# EAGLE schematic sensorBoardSchematic (EAGLE 7.5.0)
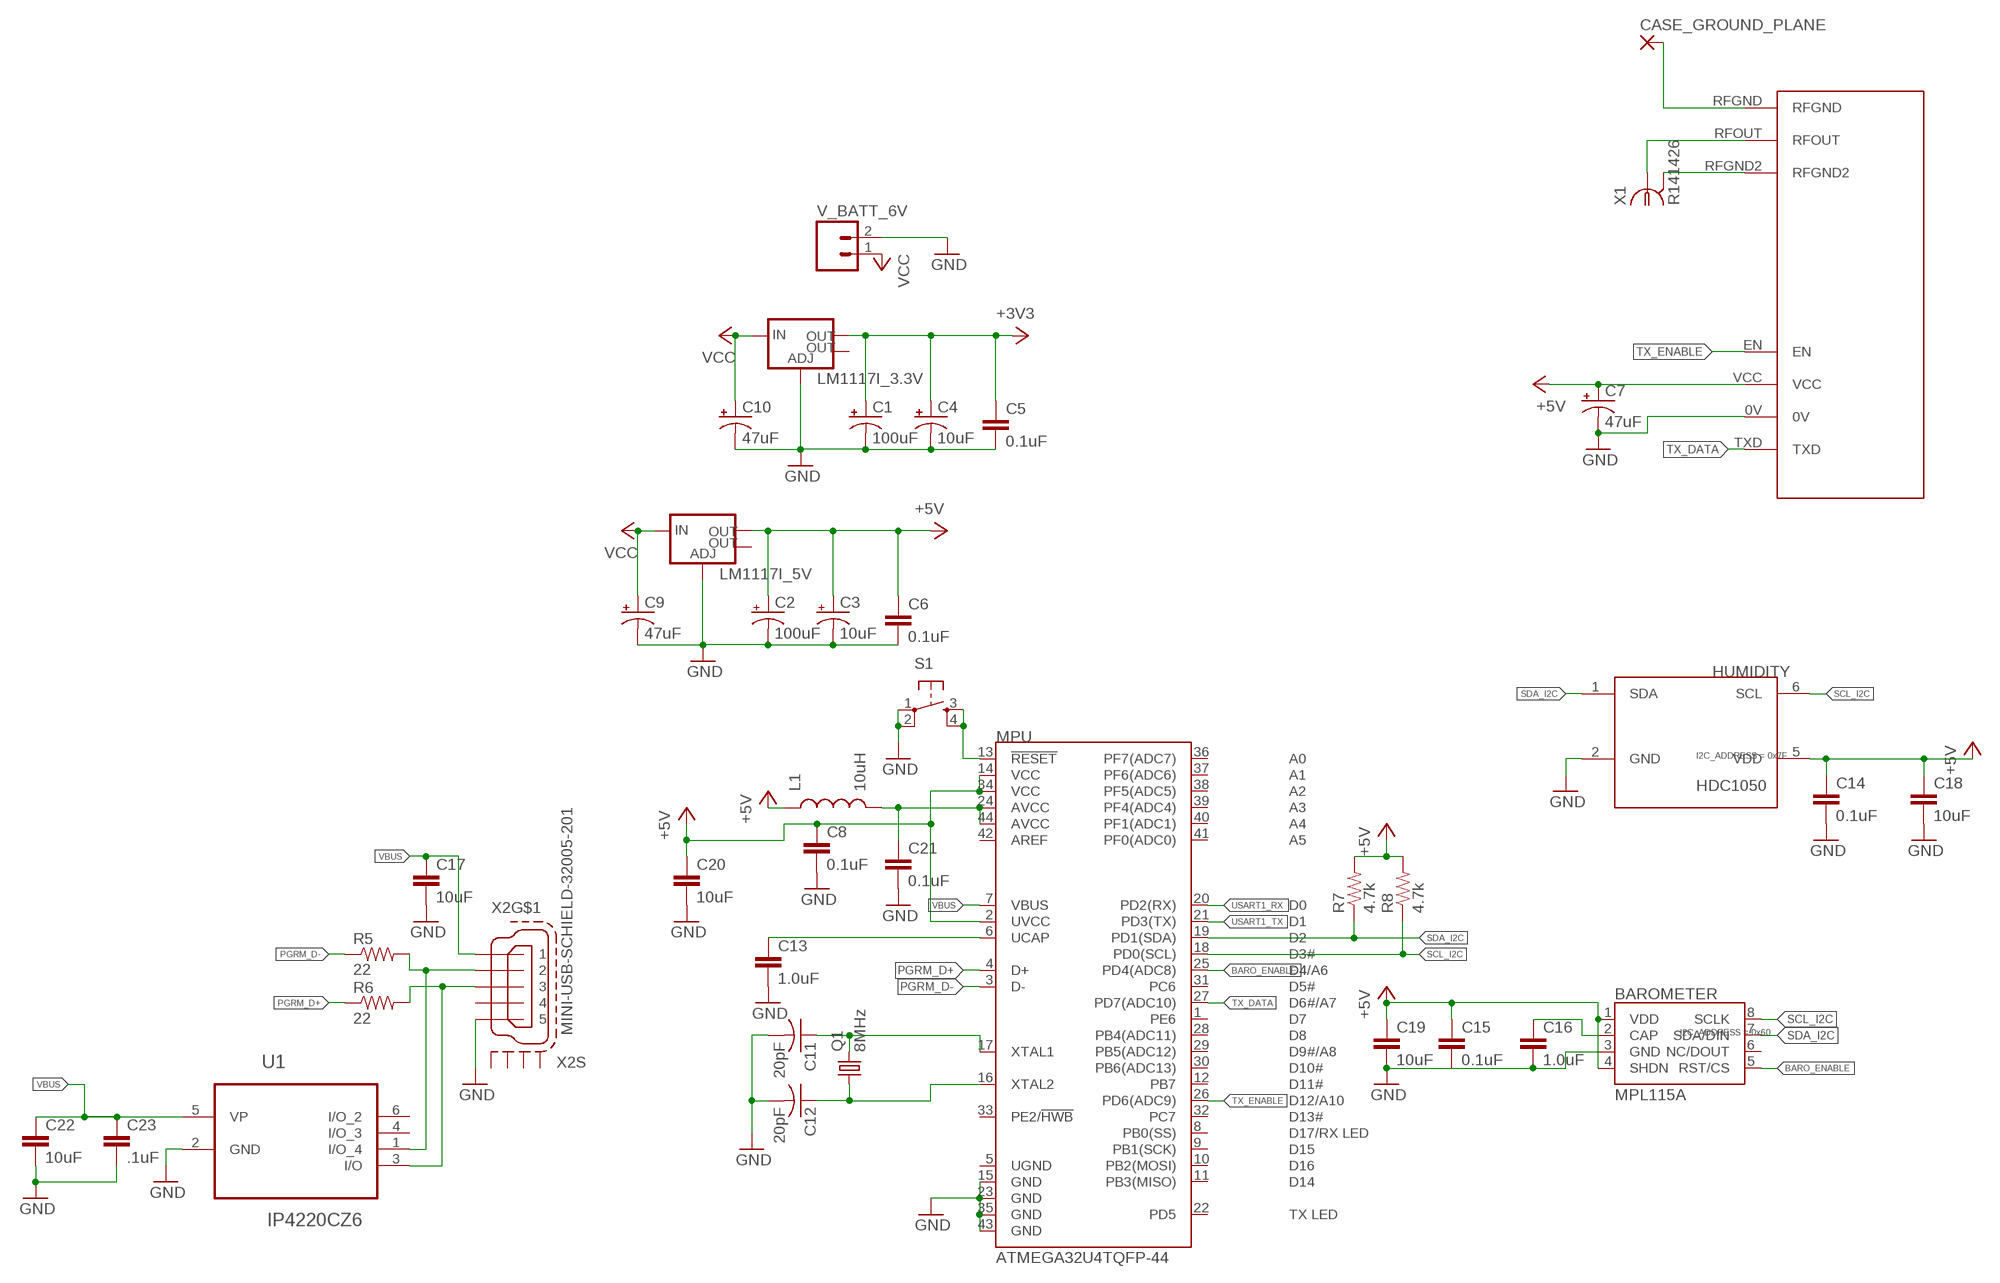
[diagram p0: schematic, sheet 1]

## Parts
BAROMETER  MPL115A  [LGA8]
C1  100uF  100UF-10V-10%(TANT)  [EIA7343]
C2  100uF  100UF-10V-10%(TANT)  [EIA7343]
C3  10uF  10UF-TANT  [EIA3216]
C4  10uF  10UF-TANT  [EIA3216]
C5  0.1uF  .1UF-CERCAP-08604  [0402-CAP]
C6  0.1uF  .1UF-CERCAP-08604  [0402-CAP]
C7  47uF  47UF-10V-10%(TANT)  [EIA3528]
C8  0.1uF  1.0UF-16V-10%(0603)  [0603-CAP]
C9  47uF  47UF-10V-10%(TANT)  [EIA3528]
C10  47uF  47UF-10V-10%(TANT)  [EIA3528]
C11  20pF  C-USC0402  [C0402]
C12  20pF  C-USC0402  [C0402]
C13  1.0uF  1.0UF-16V-10%(0603)  [0603-CAP]
C14  0.1uF  1.0UF-16V-10%(0603)  [0603-CAP]
C15  0.1uF  1.0UF-16V-10%(0603)  [0603-CAP]
C16  1.0uF  1.0UF-16V-10%(0603)  [0603-CAP]
C17  10uF  1.0UF-16V-10%(0603)  [0603-CAP]
C18  10uF  1.0UF-16V-10%(0603)  [0603-CAP]
C19  10uF  1.0UF-16V-10%(0603)  [0603-CAP]
C20  10uF  1.0UF-16V-10%(0603)  [0603-CAP]
C21  0.1uF  1.0UF-16V-10%(0603)  [0603-CAP]
C22  10uF  1.0UF-16V-10%(0603)  [0603-CAP]
C23  .1uF  1.0UF-16V-10%(0603)  [0603-CAP]
CASE_GROUND_PLANE  3,81/1,4  [3,81/1,4]
HUMIDITY  HDC1050  [TI-S-PWSON-N6]
L1  10uH  INDUCTOR1007  [1007]
LM1117I_3.3V  V_REG_LM1117SOT223  [SOT223]
LM1117I_5V  V_REG_LM1117SOT223  [SOT223]
MPU  ATMEGA32U4TQFP-44  [TQFP44]
Q1  8MHz  CRYSTALHC49U70  [HC49U70]
R5  22  RESISTOR0402-RES  [0402-RES]
R6  22  RESISTOR0402-RES  [0402-RES]
R7  4.7k  RESISTOR0402-RES  [0402-RES]
R8  4.7k  RESISTOR0402-RES  [0402-RES]
S1  TAC_SWITCHPTH  [TACTILE-PTH]
U1  IP4220CZ6  [SOT95P275X110-6N]
U$1  RADIOMETRIX-HX1  [RADIOMETRIX-HX1]
V_BATT_6V  M025MM  [SCREWTERMINAL-5MM-2]
X1  R141426  [R141426]
X2  MINI-USB-SCHIELD-32005-201  [32005-201]

## Nets
+3V3: C1.A(+) C4.A(+) C5.1 LM1117I_3.3V.2(OUT)
+5V: BAROMETER.1(VDD) BAROMETER.4(SHDN) C2.A(+) C3.A(+) C6.1 C7.A(+) C8.1 C14.1 C15.1 C18.1 C19.1 C20.1 HUMIDITY.5(VDD) L1.1 LM1117I_5V.2(OUT) MPU.2(UVCC) MPU.14(VCC) MPU.34(VCC) R7.2 R8.2 U$1.VCC
BARO_ENABLE: BAROMETER.5(RST/CS) MPU.25(PD4(ADC8))
GND: BAROMETER.3(GND) C1.C(-) C2.C(-) C3.C(-) C4.C(-) C5.2 C6.2 C7.C(-) C8.2 C9.C(-) C10.C(-) C11.2 C12.2 C13.2 C14.2 C15.2 C16.2 C17.2 C18.2 C19.2 C20.2 C21.2 C22.2 C23.2 HUMIDITY.2(GND) LM1117I_3.3V.1(ADJ) LM1117I_5V.1(ADJ) MPU.15(GND) MPU.23(GND) MPU.35(GND) MPU.43(GND) S1.1 S1.2 U1.2(GND) U$1.0V V_BATT_6V.2 X2.5
N$1: MPU.13(!RESET) S1.3 S1.4
N$2: U$1.RFOUT X1.1
N$3: U$1.RFGND2 X1.2 X1.3 X1.4 X1.5
N$4: C21.1 L1.2 MPU.24(AVCC) MPU.44(AVCC)
N$6: C11.1 MPU.17(XTAL1) Q1.2
N$7: BAROMETER.2(CAP) C16.1
N$8: C12.1 MPU.16(XTAL2) Q1.1
N$9: CASE_GROUND_PLANE.1(P) U$1.RFGND
N$10: R5.2 U1.1(I/O_4) X2.2
N$11: R6.2 U1.3(I/O) X2.3
N$12: C13.1 MPU.6(UCAP)
N$13: X2.1
PGRM_D+: MPU.4(D+) R6.1
PGRM_D-: MPU.3(D-) R5.1
SCL_I2C: BAROMETER.8(SCLK) HUMIDITY.6(SCL) MPU.18(PD0(SCL)) R8.1
SDA_I2C: BAROMETER.7(SDA/DIN) HUMIDITY.1(SDA) MPU.19(PD1(SDA)) R7.1
TX_DATA: MPU.27(PD7(ADC10)) U$1.TXD
TX_ENABLE: MPU.26(PD6(ADC9)) U$1.EN
USART1_RX: MPU.20(PD2(RX))
USART1_TX: MPU.21(PD3(TX))
VBUS: C17.1 C22.1 C23.1 MPU.7(VBUS) U1.5(VP)
VCC: C9.A(+) C10.A(+) LM1117I_3.3V.3(IN) LM1117I_5V.3(IN) V_BATT_6V.1
Unconnected: BAROMETER.6(NC/DOUT) LM1117I_3.3V.4(OUT) LM1117I_5V.4(OUT) MPU.1(PE6) MPU.5(UGND) MPU.8(PB0(SS)) MPU.9(PB1(SCK)) MPU.10(PB2(MOSI)) MPU.11(PB3(MISO)) MPU.12(PB7) MPU.22(PD5) MPU.28(PB4(ADC11)) MPU.29(PB5(ADC12)) MPU.30(PB6(ADC13)) MPU.31(PC6) MPU.32(PC7) MPU.33(PE2/!HWB) MPU.36(PF7(ADC7)) MPU.37(PF6(ADC6)) MPU.38(PF5(ADC5)) MPU.39(PF4(ADC4)) MPU.40(PF1(ADC1)) MPU.41(PF0(ADC0)) MPU.42(AREF) U1.4(I/O_3) U1.6(I/O_2) X2.4 X2.M1(S:S1) X2.M2(S:S2) X2.M3(S:S3) X2.M4(S:S4)

## Library data of the parts
BAROMETER = SparkFun-Sensors:MPL115A: MPL115A1 (SPI) and MPL115A2 (I2C) Miniature Digital Barometer 5.0x3.0x1.2mm LGA Package; I2C_ADDRESS: 0x60
C1 C2 = SparkFun-Capacitors:100UF-10V-10%(TANT): CAP-07890; PROD_ID: CAP-07890
C3 C4 = SparkFun-Retired:10UF-TANT: 10uF Tantalum SMT CAP-00811- 16V 10% (EIA-3216); PROD_ID: CAP-00811
C5 C6 = SparkFun-Retired:.1UF-CER: .1uF ceramic SMT CAP-00810- 25V +80%/-20% (0603) CAP-08390- 100V 10% (0603) CAP-08604- 25V 5% (0603); PROD_ID: CAP-08604
C7 C9 C10 = SparkFun-Capacitors:47UF-10V-10%(TANT): CAP-08310 47uF Tantalum SMT 10V 10% (EIA-3528); PROD_ID: CAP-08310
C8 C14 C15 C17-C23 = SparkFun-Capacitors:1.0UF-16V-10%(0603): CAP-00868; PROD_ID: CAP-00868; VALUE: 1.0uF
C11 C12 = resistor:C-US: CAPACITOR, American symbol
C13 C16 = SparkFun-Capacitors:1.0UF-16V-10%(0603): CAP-00868; PROD_ID: CAP-00868
CASE_GROUND_PLANE = wirepad:3,81/1,4: THROUGH-HOLE PAD
HUMIDITY = Ava:HDC1050; I2C_ADDRESS: 0x7F
L1 = SparkFun-Passives:INDUCTOR: Inductors Basic Inductor/Choke - 0603 and 1206. Footprints are not proven and vary greatly between part numbers. INDUCTOR POWER 3.3UH 4.0A SMD 0.197" L x 0.197" W x 0.177" H (5.00mm x 5.00mm x 4.50mm)
LM1117I_3.3V LM1117I_5V = SparkFun-PowerIC:V_REG_LM1117: Voltage Regulator LM1117 Standard adjustable voltage regulator but in SMD form. Spark Fun Electronics SKU : COM-00595; PROD_ID: VREG-08170
MPU = SparkFun-DigitalIC:ATMEGA32U4: Atmel 44-pin 8-bit Microcontroller with 32KBytes of ISP Flash and USB Controller
Q1 = crystal:CRYSTAL: CRYSTAL; OC_FARNELL: unknown; OC_NEWARK: unknown
R5-R8 = SparkFun-Passives:RESISTOR: Resistor Basic schematic elements and footprints for 0603, 1206, and PTH resistors.
S1 = SparkFun-Retired:TAC_SWITCH: Momentary Switch Button commonly used for reset or general input. Spark Fun Electronics SKU : COM-00097 SMT- SWCH-08247
U1 = NXP_By_element14_Batch_1:IP4220CZ6: Dual Schmitt-Trigger Inverter; MPN: IP4220CZ6; OC_FARNELL: 1506629; OC_NEWARK: 61M6815; PACKAGE: SSOT-6; SUPPLIER: NXP
U$1 = Ava:RADIOMETRIX-HX1
V_BATT_6V = SparkFun-Connectors:M02: Standard 2-pin 0.1" header. Use with - straight break away headers ( PRT-00116) - right angle break away headers (PRT-00553) - swiss pins (PRT-00743) - machine pins (PRT-00117) - female headers (PRT-00115) Molex polarized connector foot print use with: PRT-08233 with associated crimp pins and housings. 2.54_SCREWTERM for use with PRT-10571. 3.5mm Screw Terminal footprints for PRT-08084 5mm Screw Terminal footprints for use with PRT-08432; STOREFRONT_ID: PRT-08432
X1 = con-coax:R141426: BNC COAX CONNECTOR Radiall 50/75 Ohm Spoerle; MF: FARNELL; MPN: R141426161; OC_FARNELL: 4195115; OC_NEWARK: 14J7919
X2 = con-cypressindustries:MINI-USB-SCHIELD-: MINI USB-B Conector Source: www.cypressindustries.com; OC_FARNELL: unknown; OC_NEWARK: unknown